# Altium project Charging Circuit.PrjPCB
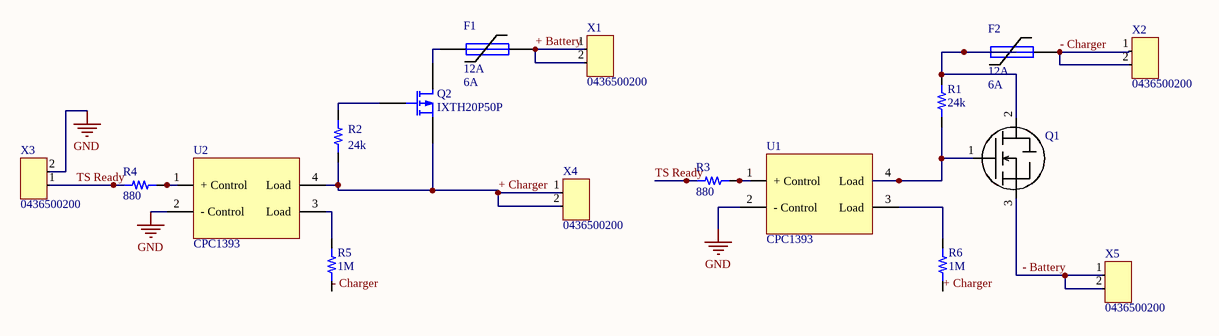
[diagram p0: Sheet1.SchDoc]
1 sheet, 17 parts. Net scope: global (net labels, ports and power ports of the same name join across sheets).
Board file: Charging Board.PcbDoc

## Sheet Sheet1.SchDoc
size A

### Parts
F1  12A  I_hold: 6A  [PIN-W2/E2.8]
F2  12A  I_hold: 6A  [PIN-W2/E2.8]
Q1  STW20NK50Z  [TO-247]  (value not drawn)
Q2  IXTH20P50P  [TO-247]
R1  value 24k  [Axial 25.4mm Pitch]  (hidden comment: Resistor 2W TH)
R2  value 24k  [Axial 25.4mm Pitch]  (hidden comment: Resistor 2W TH)
R3  value 880  [RES 0805/2012]  (hidden comment: Resistor 820 0805 1/10W 10%)
R4  value 880  [RES 0805/2012]  (hidden comment: Resistor 820 0805 1/10W 10%)
R5  value 1M  [Axial 25.4mm Pitch]  (hidden comment: Resistor 2W TH)
R6  value 1M  [Axial 25.4mm Pitch]  (hidden comment: Resistor 2W TH)
U1  CPC1393  [CPC1393GR]
U2  CPC1393  [CPC1393GR]
X1  0436500200  [CONN 43650-0200 MOLEX 2PIN]
X2  0436500200  [CONN 43650-0200 MOLEX 2PIN]
X3  0436500200  [CONN 43650-0200 MOLEX 2PIN]
X4  0436500200  [CONN 43650-0200 MOLEX 2PIN]
X5  0436500200  [CONN 43650-0200 MOLEX 2PIN]

### Nets
GND: U1.2(-_Control) U2.2(-_Control) X3.2
+ Battery: F1.2 X1.1 X1.2
+ Charger: Q2.3(S) R2.1 R6.1 U2.4(Load) X4.1 X4.2
- Battery: Q1.3(Source) X5.1 X5.2
- Charger: F2.2 R5.1 X2.1 X2.2
TS Ready: R3.1 R4.1 X3.1
NetF1_1: F1.1 Q2.2(D)
NetF2_1: F2.1 Q1.2(D) R1.2
NetQ1_1: Q1.1(Gate) R1.1 U1.4(Load)
NetQ2_1: Q2.1(G) R2.2
NetR3_2: R3.2 U1.1(+_Control)
NetR4_2: R4.2 U2.1(+_Control)
NetR5_2: R5.2 U2.3(Load)
NetR6_2: R6.2 U1.3(Load)

### Library data of the parts
F1 F2 = 9: Fuse; Manufacturer_id: 1; idFuse: 9; Name: 2920L600/12MR; Value: 6A; I_max: 50A; V_max: 12V; Published: 8-Jun-2000; LatestRevisionDate: 17-Jul-2002; LatestRevisionNote: Re-released for DXP Platform.; PackageReference: PIN-W2/E2.8; Publisher: Altium Limited; PackageDescription: Thru-Hole; 2 Leads; Drawer_id: 1; I_trip: 12A; MfrPartNo: 2920L600/12MR; Link: https://www.digikey.com/product-detail/en/littelfuse-inc/2920L600-12MR/F8137CT-ND/6234831
Q1 = 9: N-Channel 500V 17A (Tc) 190W (Tc) Through Hole TO-247-3; Manufacturer_id: 1; idFETs: 9; Value: N_Channel; Rds_On: Null; Vgs(Max): None; Created_By: Lynette; Drawer_id: 1; Name: STW20NK50Z; Vdss: 500V; Num_Circuits: 1; Id: 17A; Vgs(typ): Null; Power(Max): 190W; Package: TO-247; MfrPartNo: STW20NK50Z; Link: https://www.digikey.com/product-detail/en/stmicroelectronics/STW20NK50Z/497-3261-5-ND/654635; ComponentLink1Description: Null; ComponentLink1URL: https://www.digikey.com/product-detail/en/stmicroelectronics/STW20NK50Z/497-3261-5-ND/654635; Supplier1: Digi-Key; Supplier1PartNo: 497-3261-5-ND; Updated_By: Null
Q2 = 10: P-Channel 500V 20A (Tc) 460W (Tc) Through Hole TO-247 (IXTH); Manufacturer_id: 1; idFETs: 10; Value: P_Channel; Rds_On: Null; Vgs(Max): None; Created_By: Lynette; Drawer_id: 1; Name: IXTH20P50P; Vdss: 500V; Num_Circuits: 1; Id: 20A; Vgs(typ): Null; Power(Max): 460W; Package: TO-247; MfrPartNo: IXTH20P50P; Link: https://www.digikey.com/product-detail/en/ixys/IXTH20P50P/IXTH20P50P-ND/1995374; ComponentLink1Description: Null; ComponentLink1URL: Null; Supplier1: Digi-Key; Supplier1PartNo: IXTH20P50P-ND; Updated_By: Null
R1 R2 R5 R6 = 2707: 2W TH resistor; Manufacturer_id: 1; idResistor: 2707; Name: PR02; Tolerance: 5%; Created_By: Graydon; Supplier Part Number 1: Digi-Key; Drawer_id: 1; Power: 2W; Package: Axial; Link: https://www.digikey.com/products/en/resistors/through-hole-resistors/53?FV=ffec4976; ComponentLink1Description: Datasheet; Created_Date: 2018-12-01
R3 R4 = 2412: Manufacturer_id: 1; idResistor: 2412; Name: Res_820_0805_1/10W_10%; Created_By: Nick Mah; Supplier 1: Digi-Key; Drawer_id: 1; Tolerance: 10%; Power: 1/10W; Package: 0805; ComponentLink1Description: Datasheet; Created_Date: 2018-10-20
U1 U2 = 26: Solid State Relay SPST-NO (1 Form A) 4-SMD (0.300", 7.62mm); Manufacturer_id: 1; MfrPartNo: CPC1393GRTR; idIC_Misc: 26; Value: Null; Created_By: Lynette; Drawer_id: 1; Name: CPC1393; Type: Null; Protocol: Null; Num_Circuits: 1; Data_Rate: Null; Vin(Min): Null; Vin(Max): Null; Package: CPC1393GR; Link: https://www.digikey.com/product-detail/en/ixys-integrated-circuits-division/CPC1393GRTR/CLA270CT-ND/1277144; ComponentLink1Description: Null; ComponentLink1URL: Null; Supplier1: Null; Supplier1PartNo: Null; Updated_By: Null
X1-X5 = 9: Manufacturer_id: 4; idConn: 9; Drawer_id: 1; Name: Molex 43650_0200; Value: CONN; Num_Contacts: 2; Pitch: 3 mm; Created_By: Nick; MfrPartNo: 0436500200; Num_Rows: 1; Link: https://www.digikey.com/product-detail/en/molex-llc/0436500200/WM1860-ND/268989; ComponentLink1Description: Datasheet; ComponentLink1URL: https://www.molex.com/pdm_docs/sd/436500200_sd.pdf; Supplier1: Digi-Key; Supplier1PartNo: WM1860-ND